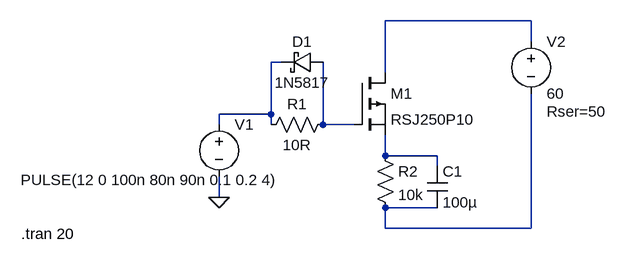
[diagram p0: schematic PMOSFET.asc]
PMOSFET.asc, the LTspice schematic file:
Version 4
SHEET 1 880 680
WIRE 464 16 240 16
WIRE 464 48 464 16
WIRE 80 80 64 80
WIRE 240 96 240 16
WIRE 64 160 64 80
WIRE 64 160 -16 160
WIRE -16 176 -16 160
WIRE 64 176 64 160
WIRE 144 176 144 80
WIRE 192 176 144 176
WIRE 240 224 240 192
WIRE 320 224 240 224
WIRE 320 240 320 224
WIRE -16 288 -16 256
WIRE 320 304 240 304
WIRE 240 336 240 304
WIRE 464 336 464 128
WIRE 464 336 240 336
FLAG -16 288 0
SYMBOL pmos 192 96 R0
SYMATTR InstName M1
SYMATTR Value RSJ250P10
SYMBOL voltage -16 160 R0
WINDOW 3 -305 101 Left 2
WINDOW 123 0 0 Left 0
WINDOW 39 -139 134 Left 2
SYMATTR InstName V1
SYMATTR Value PULSE(12 0 100n 80n 90n 0.1 0.2 4)
SYMBOL res 160 160 R90
WINDOW 0 0 56 VBottom 2
WINDOW 3 32 56 VTop 2
SYMATTR InstName R1
SYMATTR Value 10R
SYMBOL schottky 144 64 R90
WINDOW 0 0 32 VBottom 2
WINDOW 3 32 32 VTop 2
SYMATTR InstName D1
SYMATTR Value 1N5817
SYMATTR Description Diode
SYMATTR Type diode
SYMBOL res 224 208 R0
SYMATTR InstName R2
SYMATTR Value 10k
SYMBOL cap 304 240 R0
SYMATTR InstName C1
SYMATTR Value 100µ
SYMBOL voltage 464 32 R0
WINDOW 123 0 0 Left 0
WINDOW 39 24 124 Left 2
SYMATTR InstName V2
SYMATTR Value 60
SYMATTR SpiceLine Rser=50
TEXT -320 344 Left 2 !.tran 20

The netlist it stands for:
* PMOSFET.asc
M1 N001 N003 N004 N004 RSJ250P10
V1 N002 0 PULSE(12 0 100n 80n 90n 0.1 0.2 4)
R1 N003 N002 10R
D1 N003 N002 1N5817
R2 N004 N005 10k
C1 N004 N005 100µ
V2 N001 N005 60 Rser=50
.model D D
.lib standard.dio
.model NMOS NMOS
.model PMOS PMOS
.lib standard.mos
.tran 20
.backanno
.end